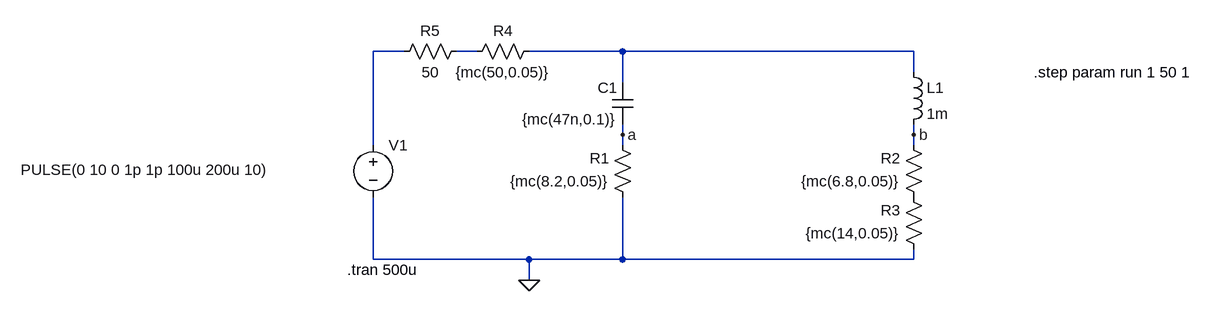
[diagram p0: schematic 2_1_MC.asc]
2_1_MC.asc, the LTspice schematic file:
Version 4.1
SHEET 1 1364 680
WIRE 128 -32 80 -32
WIRE 240 -32 208 -32
WIRE 464 -32 320 -32
WIRE 912 -32 464 -32
WIRE 912 0 912 -32
WIRE 464 16 464 -32
WIRE 464 96 464 80
WIRE 912 96 912 80
WIRE 80 112 80 -32
WIRE 464 112 464 96
WIRE 912 112 912 96
WIRE 80 288 80 192
WIRE 320 288 80 288
WIRE 464 288 464 192
WIRE 464 288 320 288
WIRE 912 288 912 272
WIRE 912 288 464 288
WIRE 320 320 320 288
FLAG 320 320 0
FLAG 464 96 a
FLAG 912 96 b
SYMBOL voltage 80 96 R0
WINDOW 123 0 0 Left 0
WINDOW 39 0 0 Left 0
WINDOW 3 -542 54 Left 2
SYMATTR InstName V1
SYMATTR Value PULSE(0 10 0 1p 1p 100u 200u 10)
SYMBOL cap 480 80 R180
WINDOW 0 24 56 Left 2
WINDOW 3 24 8 Left 2
SYMATTR InstName C1
SYMATTR Value {mc(47n,0.1)}
SYMBOL ind 896 -16 R0
SYMATTR InstName L1
SYMATTR Value 1m
SYMATTR SpiceLine Rser=1m
SYMBOL res 336 -48 R90
WINDOW 0 0 56 VBottom 2
WINDOW 3 32 56 VTop 2
SYMATTR InstName R4
SYMATTR Value {mc(50,0.05)}
SYMBOL res 224 -48 R90
WINDOW 0 0 56 VBottom 2
WINDOW 3 32 56 VTop 2
SYMATTR InstName R5
SYMATTR Value 50
SYMBOL res 480 208 R180
WINDOW 0 36 76 Left 2
WINDOW 3 36 40 Left 2
SYMATTR InstName R1
SYMATTR Value {mc(8.2,0.05)}
SYMBOL res 928 208 R180
WINDOW 0 36 76 Left 2
WINDOW 3 36 40 Left 2
SYMATTR InstName R2
SYMATTR Value {mc(6.8,0.05)}
SYMBOL res 928 288 R180
WINDOW 0 36 76 Left 2
WINDOW 3 36 40 Left 2
SYMATTR InstName R3
SYMATTR Value {mc(14,0.05)}
TEXT 40 304 Left 2 !.tran 500u
TEXT 1096 0 Left 2 !.step param run 1 50 1

The netlist it stands for:
* 2_1_MC.asc
V1 N001 0 PULSE(0 10 0 1p 1p 100u 200u 10)
C1 a N003 {mc(47n,0.1)}
L1 N003 b 1m Rser=1m
R4 N003 N002 {mc(50,0.05)}
R5 N002 N001 50
R1 0 a {mc(8.2,0.05)}
R2 P001 b {mc(6.8,0.05)}
R3 0 P001 {mc(14,0.05)}
.tran 500u
.step param run 1 50 1
.backanno
.end